# Altium schematic sheet 5VBuckConverterSM.SchDoc
size A; SheetNumber: 3; SheetTotal: 7; SPICEModelCacheJBXWNVDI: <root> / <DocumentId>JBXWNVDI</DocumentId> / </root>
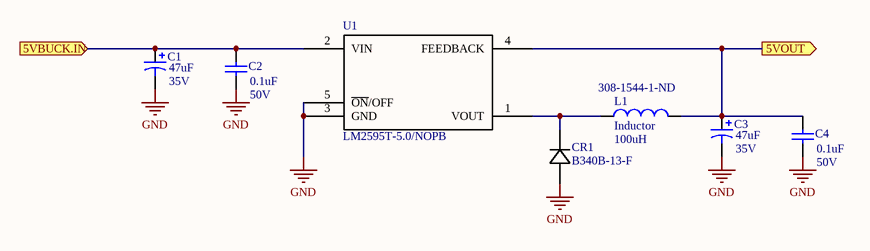
[diagram p0: 5VBuckConverterSM.SchDoc]

## Parts
C1  value 47uF  Voltage Rating: 35V  [RB7.6-15]  (hidden comment: Cap Pol1)
C2  value 0.1uF  Voltage Rating: 50V  [RAD-0.3]  (hidden comment: Cap)
C3  value 47uF  Voltage Rating: 35V  [RB7.6-15]  (hidden comment: Cap Pol1)
C4  value 0.1uF  Voltage Rating: 50V  [RAD-0.3]  (hidden comment: Cap)
CR1  B340B-13-F  [B340A-13-F]
L1  Inductor  value 100uH  Supplier Part Number 1: 308-1544-1-ND  [0402-A]
U1  LM2595T-5.0/NOPB  [LM2595ST-5P0]

## Ports
5VBUCK.IN (in), 5VOUT (out)

## Nets
GND: C1.2 C2.1 C3.2 C4.1 CR1.2 U1.3(GND) U1.5(~{ON}/OFF)
5VBUCK.IN: C1.1 C2.2 U1.2(VIN) ; port 5VBUCK.IN
5VOUT: C3.1 C4.2 L1.2 U1.4(FEEDBACK) ; port 5VOUT
NetCR1_1: CR1.1 L1.1 U1.1(VOUT)

## Library data of the parts
C1 C3 = Cap Pol1: Polarized Capacitor (Radial); Published: 8-Jun-2000; LatestRevisionDate: 17-Jul-2002; LatestRevisionNote: Re-released for DXP Platform.; PackageReference: RB7.6-15; Publisher: Altium Limited; PackageDescription: Polarized Capacitor (Radial); 2 Leads
C2 C4 = Cap: Capacitor; Published: 8-Jun-2000; LatestRevisionDate: 17-Jul-2002; LatestRevisionNote: Re-released for DXP Platform.; PackageReference: RAD-0.3; Publisher: Altium Limited; PackageDescription: Radial Cap, Thru-Hole; 2 Leads; 0.3 in Pin Spacing
CR1 = B340B-13-F: No Description Available; Mfr_Name: Diodes Inc; Type: DEV; Copyright: Copyright (C) 2022 Ultra Librarian. All rights reserved.; Manufacturer_Part_Number: B340B-13-F; Digi-Key_Part_Number_1: B340B-FDITR-ND; Digi-Key_Part_Number_2: B340B-FDIDKR-ND; Digi-Key_Part_Number_3: B340B-FDICT-ND; RefDes: RefDes
L1 = Inductor: Ind Power Shielded Wirewound 100uH 20% 100KHz 1.6A Carrier T/R; Manufacturer: Sumida; Manufacturer Part Number: CDRH125/LDNP-101MC; Code_IEC: 1005; Core Material: Ferrite; DC Resistance (DCR): 187mR; Published: 8-Jun-2000; LatestRevisionDate: 29-May-2009; LatestRevisionNote: IPC-7351 Footprint Added.; PackageReference: 0402-A; Publisher: Altium Limited; PackageDescription: Chip Inductor; Code_JEITA: 0402; Supplier 1: Digi-Key; RoHS: Yes; Category: Fixed Inductors; Stock 1: 1012; Pricing 1: 1=1.46000, 10=1.35800, 25=1.25360, 50=1.04480, 100=0.98210, 250=0.87760 (USD); Mount: Surface Mount; Case/Package: Nonstandard; Min Operating Temperature: -40°C; Max Operating Temperature: 100°C; Current Rating: 1.6A; Packaging: Tape and Reel; Tolerance: 20%; Package Quantity: 1; Shielding: Shielded; Inductance: 100uH; Test Frequency: 100kHz; Max DC Current: 1.6A; Termination: SMD/SMT; Series: CDRH125/LD; Rated Current-Max: 1.6A; Length: 0.472inch; Width: 0.472inch; Height: 6mm; Height - Seated (Max): 0.236inch; Depth: 12.3mm; Radiation Hardening: No; Lead Free: Lead Free; RoHS Compliant: Yes; ComponentLink1URL: http://www.mouser.com/ds/2/390/CDRH125LD-523473.pdf?src-supplier=Mouser; ComponentLink1Description: http://www.mouser.com/ds/2/390/CDRH125LD-523473.pdf?src-supplier=Mouser; ComponentLink2URL: http://products.sumida.com/products/pdf/CDRH125,CDRH125LD.pdf?src-supplier=Digi-Key; ComponentLink2Description: http://products.sumida.com/products/pdf/CDRH125,CDRH125LD.pdf?src-supplier=Digi-Key; ComponentLink3URL: http://www.sumida.com/products/pdf/CDRH125,CDRH125LD.pdf?src-supplier=Avnet; ComponentLink3Description: http://www.sumida.com/products/pdf/CDRH125,CDRH125LD.pdf?src-supplier=Avnet; ComponentLink4URL: http://www.sumida.com/products/pdf/CDRH125,CDRH125LD.pdf?src-supplier=Future+Electronics; ComponentLink4Description: http://www.sumida.com/products/pdf/CDRH125,CDRH125LD.pdf?src-supplier=Future+Electronics